# EAGLE schematic G_FY2015_Mez (EAGLE 6.5.0)

## Sheet 1 of 4: Raspberry Pi 2 and slow ADC/DAC
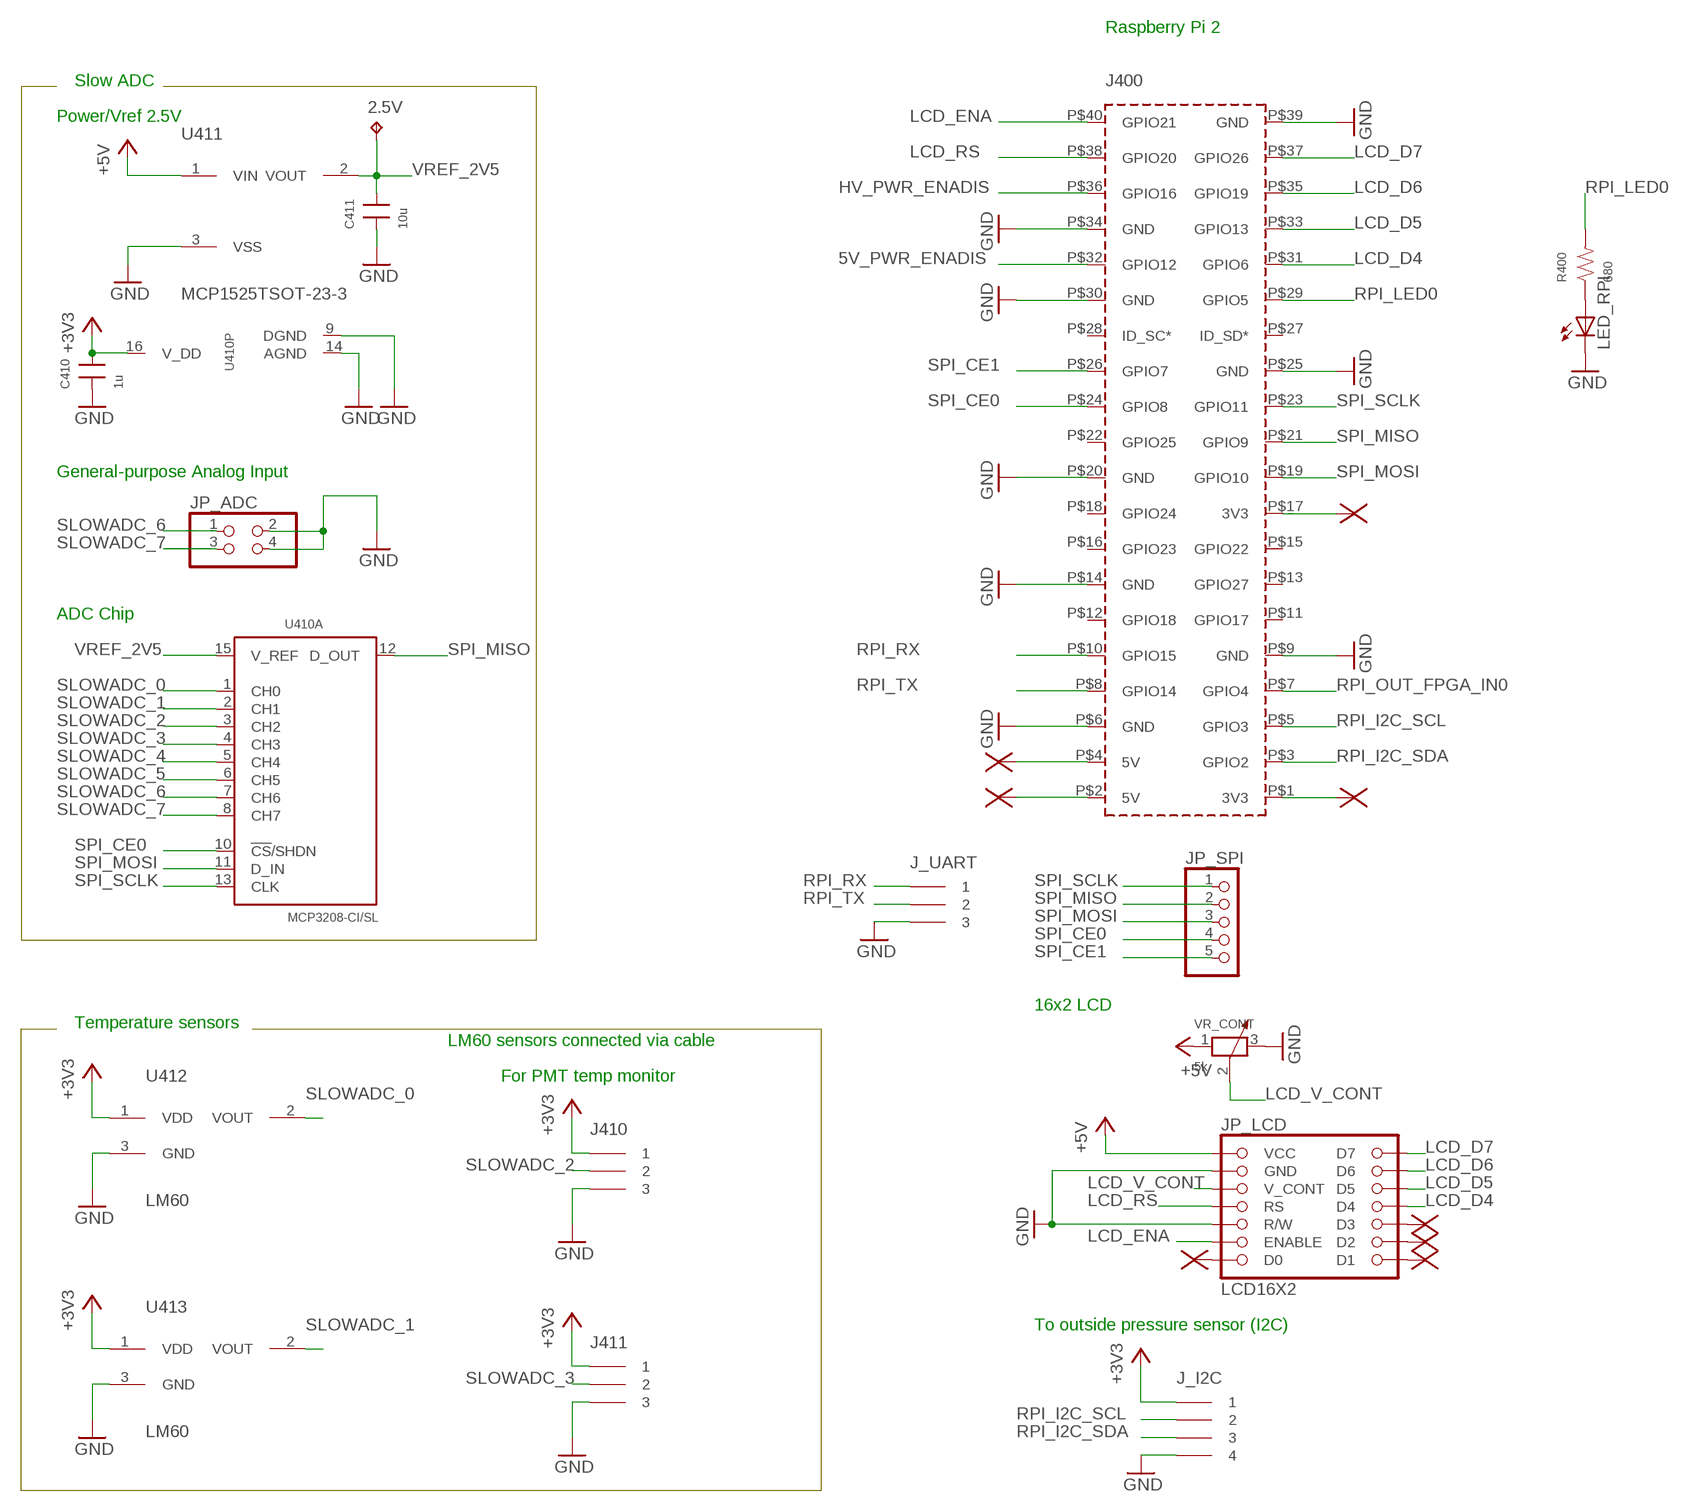
[diagram p0: schematic, sheet 1]

### Parts
2.5V  TPPAD1-13  [P1-13]
C410  1u  C226-3216  [3216]
C411  10u  C226-3216  [3216]
J400  RPI2_GPIO_HOLES  [RPI2_GPIO_HOLES]
J410  IL-3P-S3EN2  [IL-3P-S3EN2]
J411  IL-3P-S3EN2  [IL-3P-S3EN2]
J_I2C  IL-4P-S3EN2  [IL-4P-S3EN2]
J_UART  IL-3P-S3EN2  [IL-3P-S3EN2]
JP_ADC  PINHD-2X2  [2X02]
JP_LCD  LCD16X2  [LCD16X2]
JP_SPI  PINHD-1X5  [1X05]
LED_RPI  SML-311WTT86  LED_1608  [LED_1608]
R400  680  R2012  [2012]
U410  MCP3208-CI/SL  [SOIC-16(150MIL)(1.27MM)]
U411  MCP1525TSOT-23-3  [TSOT-23-3]
U412  LM60  [TO-92-R2.5C]
U413  LM60  [TO-92-R2.5C]
U$9  NC  (no package)
U$10  NC  (no package)
U$11  NC  (no package)
U$12  NC  (no package)
U$37  NC  (no package)
U$38  NC  (no package)
U$39  NC  (no package)
U$40  NC  (no package)
VR_CONT  5k  DIP-TRIMMER-10K-10%-1/2W(3P-9.7X5.0X9.80MM)  [ADJRP3-9.70XW5.0X9.80MM]

### Nets
5V_PWR_ENADIS: J400.P$32(GPIO12) ; also sheet 4
+3V3 [power]: C410.2 J410.P$1 J411.P$1 J_I2C.P$1 U410.16(P:V_DD) U412.1(VDD) U413.1(VDD) ; also sheet 2,4
+5V [power]: JP_LCD.1(VCC) U411.1(VIN) VR_CONT.1 ; also sheet 2,4
GND [power]: C410.1 C411.1 J400.P$6(GND) J400.P$9(GND) J400.P$14(GND) J400.P$20(GND) J400.P$25(GND) J400.P$30(GND) J400.P$34(GND) J400.P$39(GND) J410.P$3 J411.P$3 J_I2C.P$4 J_UART.P$3 JP_ADC.2 JP_ADC.4 JP_LCD.2(GND) JP_LCD.5(R/W) LED_RPI.P$2(C) U410.9(P:DGND) U410.14(P:AGND) U411.3(VSS) U412.3(GND) U413.3(GND) VR_CONT.3 ; also sheet 2,3,4
HV_PWR_ENADIS: J400.P$36(GPIO16) ; also sheet 3
LCD_D4: J400.P$31(GPIO6) JP_LCD.11(D4)
LCD_D5: J400.P$33(GPIO13) JP_LCD.12(D5)
LCD_D6: J400.P$35(GPIO19) JP_LCD.13(D6)
LCD_D7: J400.P$37(GPIO26) JP_LCD.14(D7)
LCD_ENA: J400.P$40(GPIO21) JP_LCD.6(ENABLE)
LCD_RS: J400.P$38(GPIO20) JP_LCD.4(RS)
LCD_V_CONT: JP_LCD.3(V_CONT) VR_CONT.2
N$51: J400.P$1(3V3) U$11.NC
N$52: J400.P$17(3V3) U$12.NC
N$56: J400.P$4(5V) U$9.NC
N$57: J400.P$2(5V) U$10.NC
N$69: LED_RPI.P$1(A) R400.1
N$94: JP_LCD.8(D1) U$37.NC
N$95: JP_LCD.9(D2) U$38.NC
N$96: JP_LCD.10(D3) U$39.NC
N$97: JP_LCD.7(D0) U$40.NC
RPI_I2C_SCL: J400.P$5(GPIO3) J_I2C.P$2
RPI_I2C_SDA: J400.P$3(GPIO2) J_I2C.P$3
RPI_LED0: J400.P$29(GPIO5) R400.2
RPI_OUT_FPGA_IN0: J400.P$7(GPIO4) ; also sheet 2
RPI_RX: J400.P$10(GPIO15) J_UART.P$1
RPI_TX: J400.P$8(GPIO14) J_UART.P$2
SLOWADC_0: U410.1(A:CH0) U412.2(VOUT)
SLOWADC_1: U410.2(A:CH1) U413.2(VOUT)
SLOWADC_2: J410.P$2 U410.3(A:CH2)
SLOWADC_3: J411.P$2 U410.4(A:CH3)
SLOWADC_4: U410.5(A:CH4) ; also sheet 4
SLOWADC_5: U410.6(A:CH5) ; also sheet 4
SLOWADC_6: JP_ADC.1 U410.7(A:CH6)
SLOWADC_7: JP_ADC.3 U410.8(A:CH7)
SPI_CE0: J400.P$24(GPIO8) JP_SPI.4 U410.10(A:!CS!/SHDN)
SPI_CE1: J400.P$26(GPIO7) JP_SPI.5
SPI_MISO: J400.P$21(GPIO9) JP_SPI.2 U410.12(A:D_OUT)
SPI_MOSI: J400.P$19(GPIO10) JP_SPI.3 U410.11(A:D_IN)
SPI_SCLK: J400.P$23(GPIO11) JP_SPI.1 U410.13(A:CLK)
VREF_2V5: 2.5V.TP C411.2 U410.15(A:V_REF) U411.2(VOUT)
Unconnected: J400.P$11(GPIO17) J400.P$12(GPIO18) J400.P$13(GPIO27) J400.P$15(GPIO22) J400.P$16(GPIO23) J400.P$18(GPIO24) J400.P$22(GPIO25) J400.P$27(ID_SD*) J400.P$28(ID_SC*)

### Notes on the sheet
- Raspberry Pi 2
- Slow ADC
- Power/Vref 2.5V
- General-purpose Analog Input
- ADC Chip
- 16x2 LCD
- Temperature sensors
- LM60 sensors connected via cable
- For PMT temp monitor
- To outside pressure sensor (I2C)

## Sheet 2 of 4: Amp/ADC/FPGA
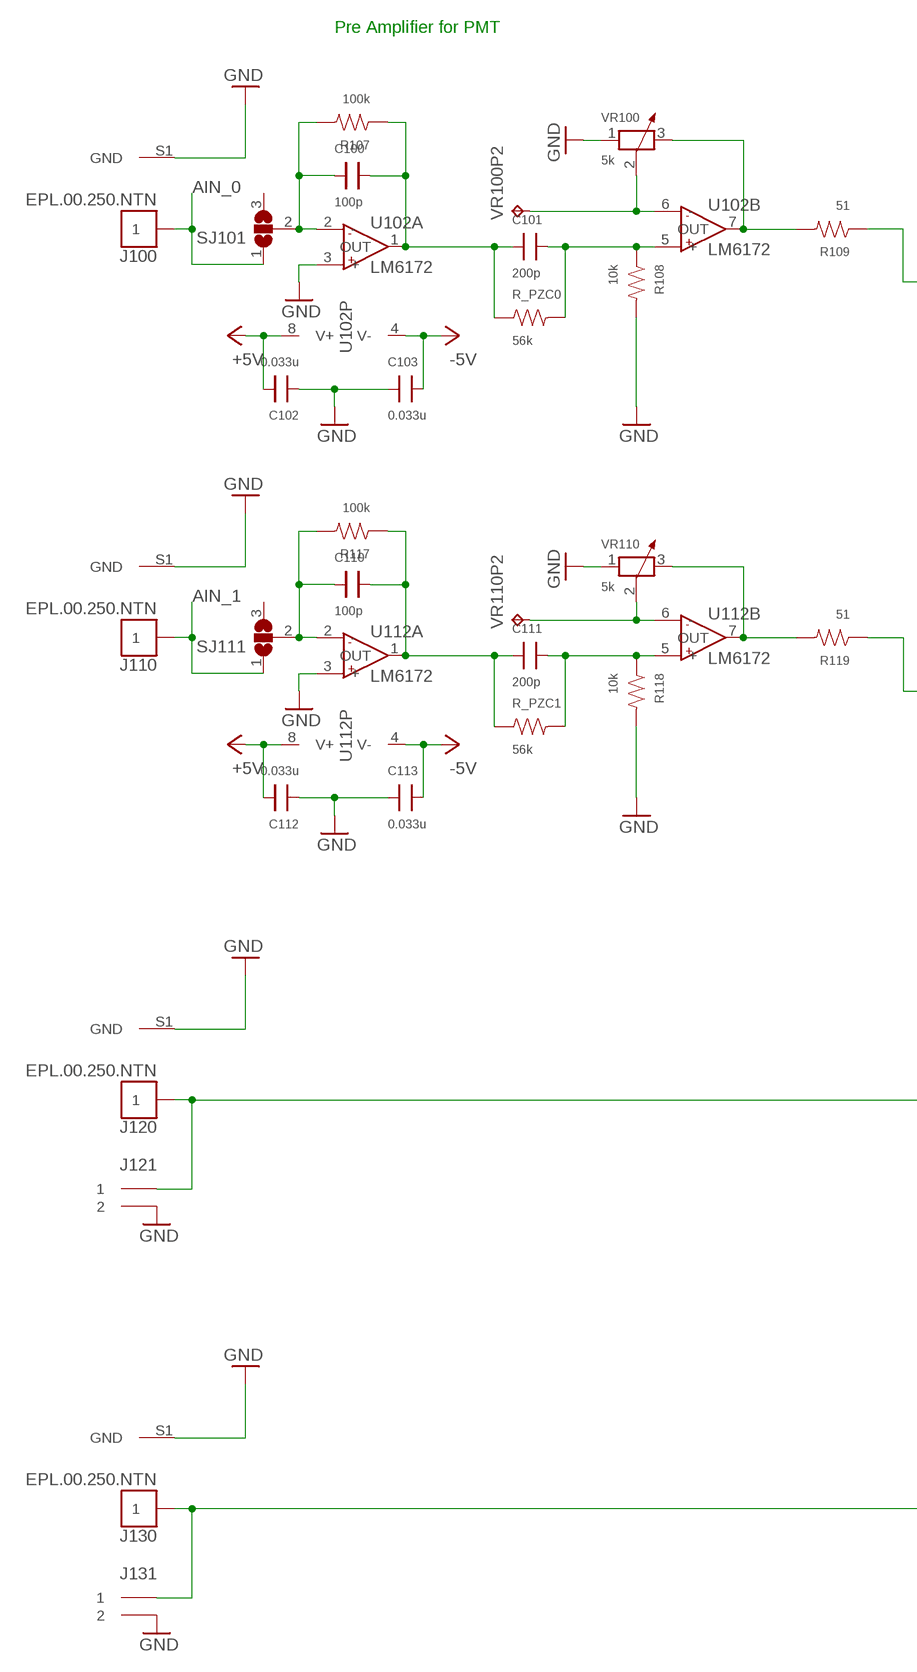
[diagram p1: schematic, sheet 2, part 1 of 2]
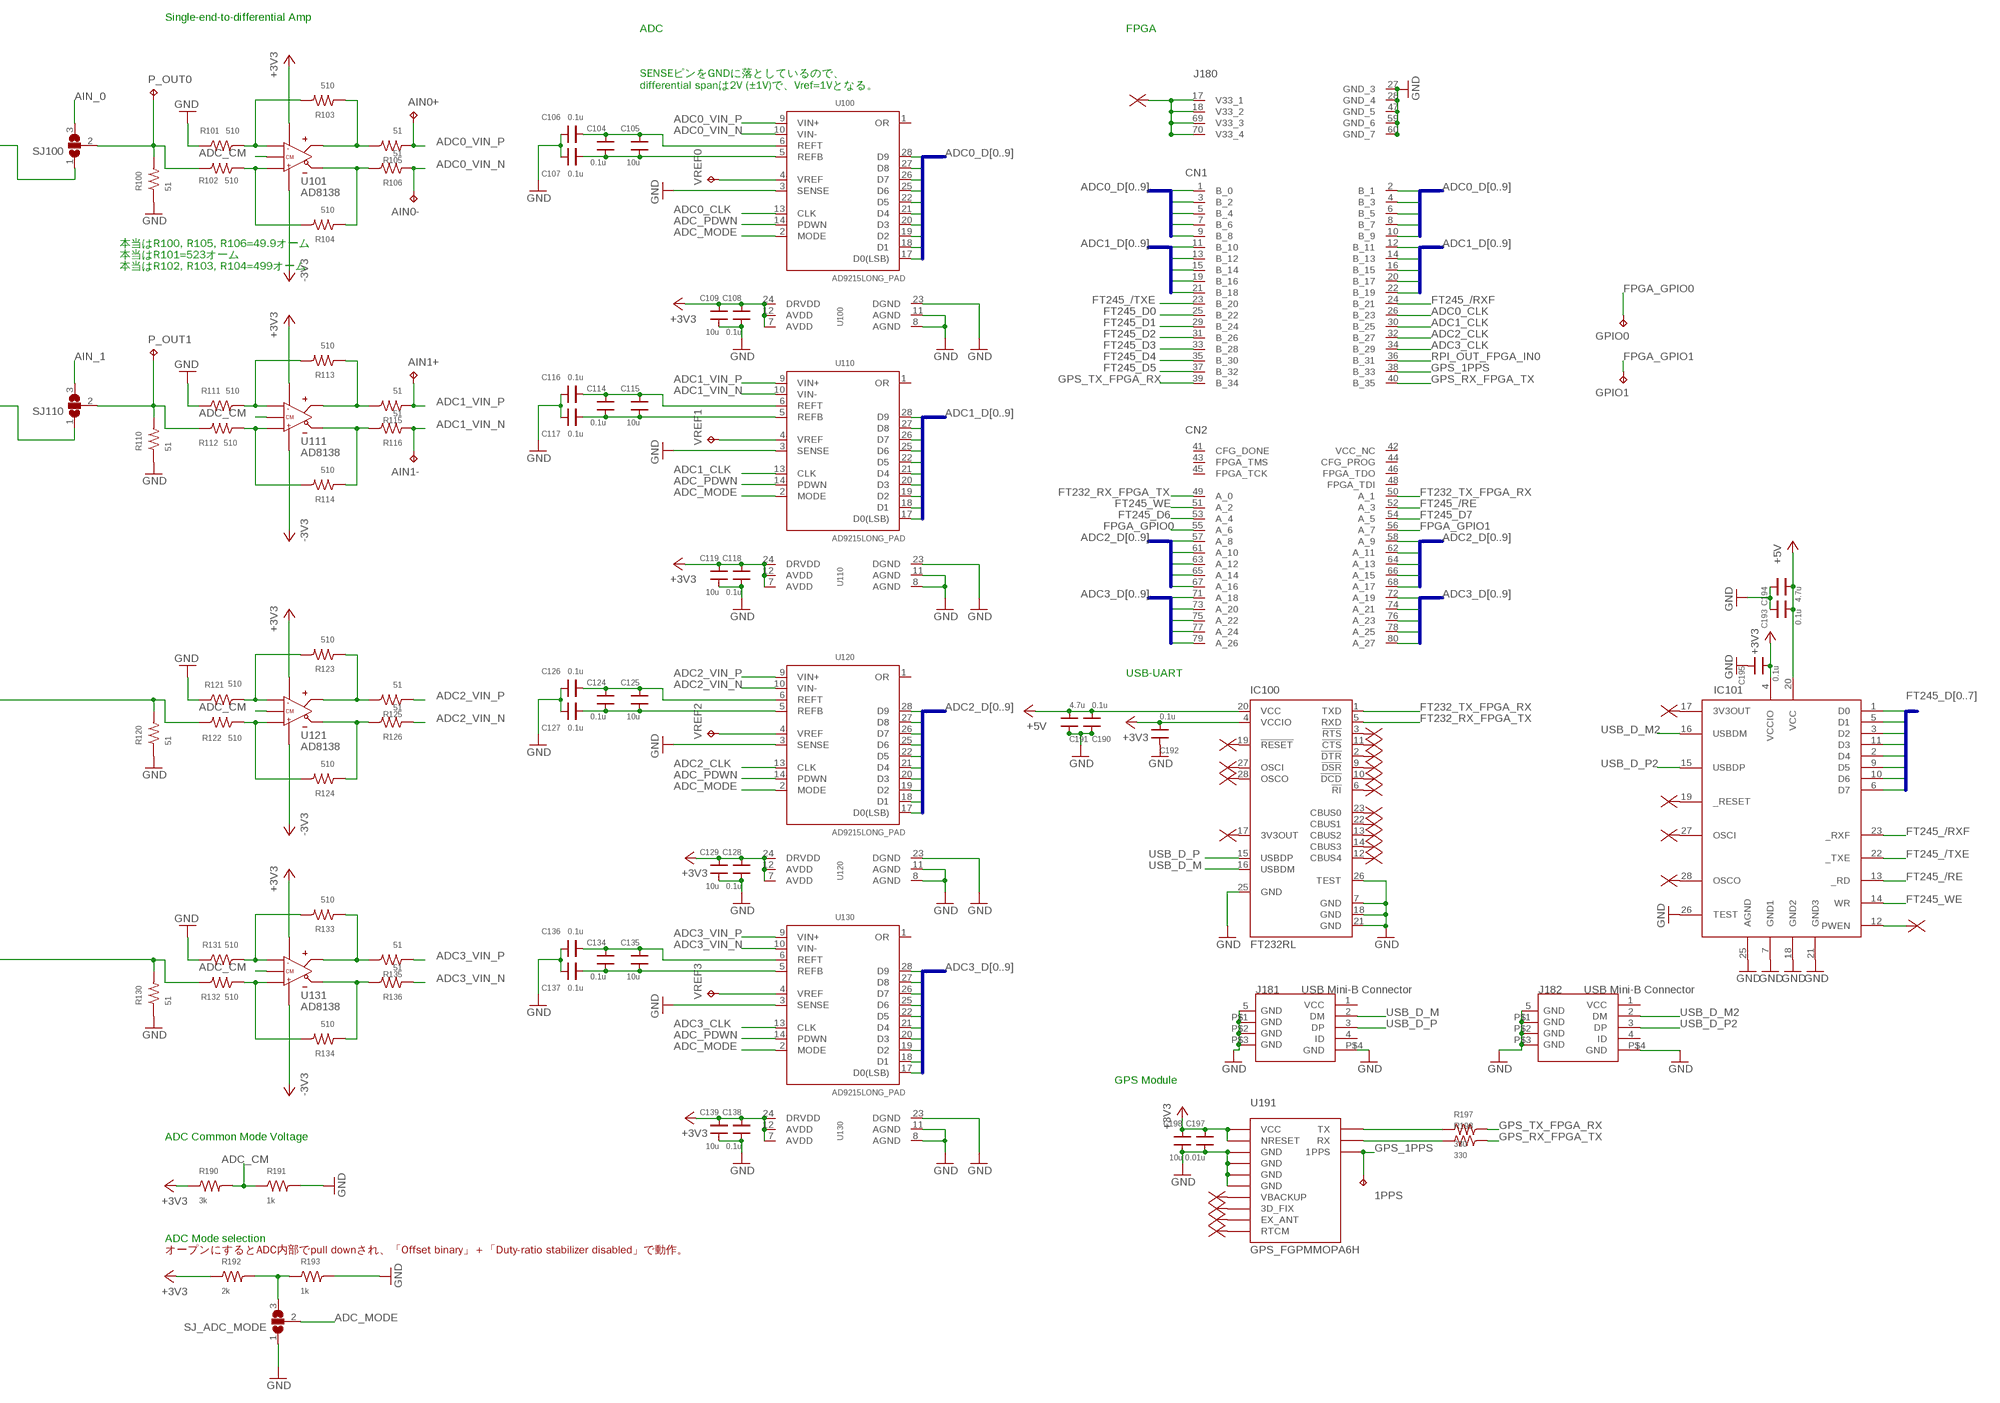
[diagram p2: schematic, sheet 2, part 2 of 2]

### Parts
1PPS  TPPAD1-13  [P1-13]
AIN0+  TPPAD1-13  [P1-13]
AIN0-  TPPAD1-13  [P1-13]
AIN1+  TPPAD1-13  [P1-13]
AIN1-  TPPAD1-13  [P1-13]
C100  100p  C2012  [C0805]
C101  200p  C2012  [C0805]
C102  0.033u  C2012  [C0805]
C103  0.033u  C2012  [C0805]
C104  0.1u  C2012  [C0805]
C105  10u  C2012  [C0805]
C106  0.1u  C2012  [C0805]
C107  0.1u  C2012  [C0805]
C108  0.1u  C2012  [C0805]
C109  10u  C2012  [C0805]
C110  100p  C2012  [C0805]
C111  200p  C2012  [C0805]
C112  0.033u  C2012  [C0805]
C113  0.033u  C2012  [C0805]
C114  0.1u  C2012  [C0805]
C115  10u  C2012  [C0805]
C116  0.1u  C2012  [C0805]
C117  0.1u  C2012  [C0805]
C118  0.1u  C2012  [C0805]
C119  10u  C2012  [C0805]
C124  0.1u  C2012  [C0805]
C125  10u  C2012  [C0805]
C126  0.1u  C2012  [C0805]
C127  0.1u  C2012  [C0805]
C128  0.1u  C2012  [C0805]
C129  10u  C2012  [C0805]
C134  0.1u  C2012  [C0805]
C135  10u  C2012  [C0805]
C136  0.1u  C2012  [C0805]
C137  0.1u  C2012  [C0805]
C138  0.1u  C2012  [C0805]
C139  10u  C2012  [C0805]
C190  0.1u  C2012  [C0805]
C191  4.7u  C2012  [C0805]
C192  0.1u  C2012  [C0805]
C193  0.1u  C2012  [C0805]
C194  4.7u  C2012  [C0805]
C195  0.1u  C2012  [C0805]
C197  0.01u  C1608  [C0603]
C198  10u  C226-3216  [3216]
GPIO0  TPPAD1-13  [P1-13]
GPIO1  TPPAD1-13  [P1-13]
IC100  FT232RL  [SSOP28]
IC101  FT245RL  [SSOP28DB]
J100  EPL.00.250.NTN  [EPL.00.250.NTN]
J110  EPL.00.250.NTN  [EPL.00.250.NTN]
J120  EPL.00.250.NTN  [EPL.00.250.NTN]
J121  IL-2P-S3EN2  [IL-2P-S3EN2]
J130  EPL.00.250.NTN  [EPL.00.250.NTN]
J131  IL-2P-S3EN2  [IL-2P-S3EN2]
J180  TOKUDEN_SP6  [TOKUDEN_SP6]
J181  USB Mini-B Connector  MINI-USB-RCPT-B-5PS-R/A-SMD(ST-USB-002A)  [MINIUSB5+4P-SMD-0.8-90D]
J182  USB Mini-B Connector  MINI-USB-RCPT-B-5PS-R/A-SMD(ST-USB-002A)  [MINIUSB5+4P-SMD-0.8-90D]
P_OUT0  TPPAD1-13  [P1-13]
P_OUT1  TPPAD1-13  [P1-13]
R100  51  R2012  [2012]
R101  510  R2012  [2012]
R102  510  R2012  [2012]
R103  510  R2012  [2012]
R104  510  R2012  [2012]
R105  51  R2012  [2012]
R106  51  R2012  [2012]
R107  100k  R2012  [2012]
R108  10k  R2012  [2012]
R109  51  R2012  [2012]
R110  51  R2012  [2012]
R111  510  R2012  [2012]
R112  510  R2012  [2012]
R113  510  R2012  [2012]
R114  510  R2012  [2012]
R115  51  R2012  [2012]
R116  51  R2012  [2012]
R117  100k  R2012  [2012]
R118  10k  R2012  [2012]
R119  51  R2012  [2012]
R120  51  R2012  [2012]
R121  510  R2012  [2012]
R122  510  R2012  [2012]
R123  510  R2012  [2012]
R124  510  R2012  [2012]
R125  51  R2012  [2012]
R126  51  R2012  [2012]
R130  51  R2012  [2012]
R131  510  R2012  [2012]
R132  510  R2012  [2012]
R133  510  R2012  [2012]
R134  510  R2012  [2012]
R135  51  R2012  [2012]
R136  51  R2012  [2012]
R190  3k  R2012  [2012]
R191  1k  R2012  [2012]
R192  2k  R2012  [2012]
R193  1k  R2012  [2012]
R197  330  R2012  [2012]
R198  330  R2012  [2012]
R_PZC0  56k  R2012  [2012]
R_PZC1  56k  R2012  [2012]
SJ100  SJ2WW  [SJ_2W]
SJ101  SJ2WW  [SJ_2W]
SJ110  SJ2WW  [SJ_2W]
SJ111  SJ2WW  [SJ_2W]
SJ_ADC_MODE  SJ2WW  [SJ_2W]
U100  AD9215LONG_PAD  [TSSOP-28(4.4MM)(0.65MM)_LONGPAD]
U101  AD8138  [SOIC-8(150MIL)(1.27MM)]
U102  LM6172  LM6172SOIC(D)8  [SOP8]
U110  AD9215LONG_PAD  [TSSOP-28(4.4MM)(0.65MM)_LONGPAD]
U111  AD8138  [SOIC-8(150MIL)(1.27MM)]
U112  LM6172  LM6172SOIC(D)8  [SOP8]
U120  AD9215LONG_PAD  [TSSOP-28(4.4MM)(0.65MM)_LONGPAD]
U121  AD8138  [SOIC-8(150MIL)(1.27MM)]
U130  AD9215LONG_PAD  [TSSOP-28(4.4MM)(0.65MM)_LONGPAD]
U131  AD8138  [SOIC-8(150MIL)(1.27MM)]
U191  GPS_FGPMMOPA6H  [GPS_FGPMMOPA6H]
U$1  NC  (no package)
U$2  NC  (no package)
U$3  NC  (no package)
U$8  NC  (no package)
U$13  NC  (no package)
U$14  NC  (no package)
U$15  NC  (no package)
U$16  NC  (no package)
U$18  NC  (no package)
U$20  NC  (no package)
U$21  NC  (no package)
U$23  NC  (no package)
U$24  NC  (no package)
U$25  NC  (no package)
U$26  NC  (no package)
U$29  NC  (no package)
U$32  NC  (no package)
U$33  NC  (no package)
U$34  NC  (no package)
U$35  NC  (no package)
U$36  NC  (no package)
U$41  NC  (no package)
U$42  NC  (no package)
U$43  NC  (no package)
U$44  NC  (no package)
VR100  5k  DIP-TRIMMER-10K-10%-1/2W(3P-9.7X5.0X9.80MM)  [ADJRP3-9.70XW5.0X9.80MM]
VR100P2  TPPAD1-13  [P1-13]
VR110  5k  DIP-TRIMMER-10K-10%-1/2W(3P-9.7X5.0X9.80MM)  [ADJRP3-9.70XW5.0X9.80MM]
VR110P2  TPPAD1-13  [P1-13]
VREF0  TPPAD1-13  [P1-13]
VREF1  TPPAD1-13  [P1-13]
VREF2  TPPAD1-13  [P1-13]
VREF3  TPPAD1-13  [P1-13]

### Nets
+3V3 [power]: C108.2 C109.2 C118.2 C119.2 C128.2 C129.2 C138.2 C139.2 C192.1 C195.1 C197.2 C198.2 IC100.4(VCCIO) IC101.4(VCCIO) R190.1 R192.1 U100.7(AVDD) U100.12(AVDD) U100.24(DRVDD) U101.3(V+) U110.7(AVDD) U110.12(AVDD) U110.24(DRVDD) U111.3(V+) U120.7(AVDD) U120.12(AVDD) U120.24(DRVDD) U121.3(V+) U130.7(AVDD) U130.12(AVDD) U130.24(DRVDD) U131.3(V+) U191.P$1(VCC) U191.P$2(NRESET) ; also sheet 1,4
+5V [power]: C102.2 C112.2 C190.1 C191.1 C193.1 C194.1 IC100.20(VCC) IC101.20(VCC) U102.8(P:V+) U112.8(P:V+) ; also sheet 1,4
-3V3: U101.6(V-) U111.6(V-) U121.6(V-) U131.6(V-) ; also sheet 4
-5V: C103.2 C113.2 U102.4(P:V-) U112.4(P:V-) ; also sheet 4
ADC0_CLK: J180.26(B_23) U100.13(CLK)
ADC0_D0: J180.1(B_0) U100.17(D0(LSB))
ADC0_D1: J180.2(B_1) U100.18(D1)
ADC0_D2: J180.3(B_2) U100.19(D2)
ADC0_D3: J180.4(B_3) U100.20(D3)
ADC0_D4: J180.5(B_4) U100.21(D4)
ADC0_D5: J180.6(B_5) U100.22(D5)
ADC0_D6: J180.7(B_6) U100.25(D6)
ADC0_D7: J180.8(B_7) U100.26(D7)
ADC0_D8: J180.9(B_8) U100.27(D8)
ADC0_D9: J180.10(B_9) U100.28(D9)
ADC0_VIN_N: AIN0-.TP R106.1 U100.10(VIN-)
ADC0_VIN_P: AIN0+.TP R105.1 U100.9(VIN+)
ADC1_CLK: J180.30(B_25) U110.13(CLK)
ADC1_D0: J180.11(B_10) U110.17(D0(LSB))
ADC1_D1: J180.12(B_11) U110.18(D1)
ADC1_D2: J180.13(B_12) U110.19(D2)
ADC1_D3: J180.14(B_13) U110.20(D3)
ADC1_D4: J180.15(B_14) U110.21(D4)
ADC1_D5: J180.16(B_15) U110.22(D5)
ADC1_D6: J180.19(B_16) U110.25(D6)
ADC1_D7: J180.20(B_17) U110.26(D7)
ADC1_D8: J180.21(B_18) U110.27(D8)
ADC1_D9: J180.22(B_19) U110.28(D9)
ADC1_VIN_N: AIN1-.TP R116.1 U110.10(VIN-)
ADC1_VIN_P: AIN1+.TP R115.1 U110.9(VIN+)
ADC2_CLK: J180.32(B_27) U120.13(CLK)
ADC2_D0: J180.57(A_8) U120.17(D0(LSB))
ADC2_D1: J180.58(A_9) U120.18(D1)
ADC2_D2: J180.61(A_10) U120.19(D2)
ADC2_D3: J180.62(A_11) U120.20(D3)
ADC2_D4: J180.63(A_12) U120.21(D4)
ADC2_D5: J180.64(A_13) U120.22(D5)
ADC2_D6: J180.65(A_14) U120.25(D6)
ADC2_D7: J180.66(A_15) U120.26(D7)
ADC2_D8: J180.67(A_16) U120.27(D8)
ADC2_D9: J180.68(A_17) U120.28(D9)
ADC2_VIN_N: R126.1 U120.10(VIN-)
ADC2_VIN_P: R125.1 U120.9(VIN+)
ADC3_CLK: J180.34(B_29) U130.13(CLK)
ADC3_D0: J180.71(A_18) U130.17(D0(LSB))
ADC3_D1: J180.72(A_19) U130.18(D1)
ADC3_D2: J180.73(A_20) U130.19(D2)
ADC3_D3: J180.74(A_21) U130.20(D3)
ADC3_D4: J180.75(A_22) U130.21(D4)
ADC3_D5: J180.76(A_23) U130.22(D5)
ADC3_D6: J180.77(A_24) U130.25(D6)
ADC3_D7: J180.78(A_25) U130.26(D7)
ADC3_D8: J180.79(A_26) U130.27(D8)
ADC3_D9: J180.80(A_27) U130.28(D9)
ADC3_VIN_N: R136.1 U130.10(VIN-)
ADC3_VIN_P: R135.1 U130.9(VIN+)
ADC_CM: R190.2 R191.1 U101.2(CM) U111.2(CM) U121.2(CM) U131.2(CM)
ADC_MODE: SJ_ADC_MODE.2 U100.2(MODE) U110.2(MODE) U120.2(MODE) U130.2(MODE)
ADC_PDWN: U100.14(PDWN) U110.14(PDWN) U120.14(PDWN) U130.14(PDWN)
AIN_0: J100.1 SJ100.3 SJ101.1
AIN_1: J110.1 SJ110.3 SJ111.1
AIN_2: J120.1 J121.P$1 R120.2 R122.2
AIN_3: J130.1 J131.P$1 R130.2 R132.2
FPGA_GPIO0: GPIO0.TP J180.55(A_6)
FPGA_GPIO1: GPIO1.TP J180.56(A_7)
FT232_RX_FPGA_TX: IC100.5(RXD) J180.49(A_0)
FT232_TX_FPGA_RX: IC100.1(TXD) J180.50(A_1)
FT245_/RE: IC101.13(_RD) J180.52(A_3)
FT245_/RXF: IC101.23(_RXF) J180.24(B_21)
FT245_/TXE: IC101.22(_TXE) J180.23(B_20)
FT245_D0: IC101.1(D0) J180.25(B_22)
FT245_D1: IC101.5(D1) J180.29(B_24)
FT245_D2: IC101.3(D2) J180.31(B_26)
FT245_D3: IC101.11(D3) J180.33(B_28)
FT245_D4: IC101.2(D4) J180.35(B_30)
FT245_D5: IC101.9(D5) J180.37(B_32)
FT245_D6: IC101.10(D6) J180.53(A_4)
FT245_D7: IC101.6(D7) J180.54(A_5)
FT245_WE: IC101.14(WR) J180.51(A_2)
GND [power]: C102.1 C103.1 C106.2 C107.2 C108.1 C109.1 C112.1 C113.1 C116.2 C117.2 C118.1 C119.1 C126.2 C127.2 C128.1 C129.1 C136.2 C137.2 C138.1 C139.1 C190.2 C191.2 C192.2 C193.2 C194.2 C195.2 C197.1 C198.1 IC100.7(GND) IC100.18(GND) IC100.21(GND) IC100.25(GND) IC100.26(TEST) IC101.7(GND1) IC101.18(GND2) IC101.21(GND3) IC101.25(AGND) IC101.26(TEST) J100.S1(GND) J110.S1(GND) J120.S1(GND) J121.P$2 J130.S1(GND) J131.P$2 J180.27(GND_3) J180.28(GND_4) J180.47(GND_5) J180.59(GND_6) J180.60(GND_7) J181.5(GND) J181.P$1(GND) J181.P$2(GND) J181.P$3(GND) J181.P$4(GND) J182.5(GND) J182.P$1(GND) J182.P$2(GND) J182.P$3(GND) J182.P$4(GND) R100.1 R101.1 R108.2 R110.1 R111.1 R118.2 R120.1 R121.1 R130.1 R131.1 R191.2 R193.2 SJ_ADC_MODE.1 U100.3(SENSE) U100.8(AGND) U100.11(AGND) U100.23(DGND) U102.3(A:+) U110.3(SENSE) U110.8(AGND) U110.11(AGND) U110.23(DGND) U112.3(A:+) U120.3(SENSE) U120.8(AGND) U120.11(AGND) U120.23(DGND) U130.3(SENSE) U130.8(AGND) U130.11(AGND) U130.23(DGND) U191.P$3(GND) U191.P$8(GND) U191.P$12(GND) U191.P$19(GND) VR100.1 VR110.1 ; also sheet 1,3,4
GPS_1PPS: 1PPS.TP J180.38(B_33) U191.P$13(1PPS)
GPS_RX_FPGA_TX: J180.40(B_35) R198.2
GPS_TX_FPGA_RX: J180.39(B_34) R197.2
N$2: R101.2 R103.2 U101.1(-)
N$10: U100.4(VREF) VREF0.TP
N$11: C104.2 C105.2 C106.1 U100.6(REFT)
N$12: U110.4(VREF) VREF1.TP
N$13: C114.2 C115.2 C116.1 U110.6(REFT)
N$14: C104.1 C105.1 C107.1 U100.5(REFB)
N$15: C114.1 C115.1 C117.1 U110.5(REFB)
N$16: U120.4(VREF) VREF2.TP
N$17: C124.2 C125.2 C126.1 U120.6(REFT)
N$18: C124.1 C125.1 C127.1 U120.5(REFB)
N$19: U130.4(VREF) VREF3.TP
N$20: C134.2 C135.2 C136.1 U130.6(REFT)
N$21: IC100.23(CBUS0) U$32.NC
N$22: IC100.22(CBUS1) U$33.NC
N$23: C134.1 C135.1 C137.1 U130.5(REFB)
N$24: IC100.10(!DCD) U$23.NC
N$25: IC100.19(!RESET) U$1.NC
N$26: IC100.9(!DSR) U$24.NC
N$27: IC100.2(!DTR) U$25.NC
N$28: IC100.6(!RI) U$26.NC
N$29: IC100.13(CBUS2) U$34.NC
N$30: IC100.14(CBUS3) U$35.NC
N$31: IC100.12(CBUS4) U$36.NC
N$32: IC100.27(OSCI) U$2.NC
N$33: IC100.28(OSCO) U$3.NC
N$35: IC100.17(3V3OUT) U$29.NC
N$36: R102.1 R104.2 U101.8(+)
N$37: R111.2 R113.2 U111.1(-)
N$38: R104.1 R106.2 U101.5(O-)
N$39: R103.1 R105.2 U101.4(O+)
N$40: R112.1 R114.2 U111.8(+)
N$41: R114.1 R116.2 U111.5(O-)
N$42: R113.1 R115.2 U111.4(O+)
N$43: R121.2 R123.2 U121.1(-)
N$44: R122.1 R124.2 U121.8(+)
N$45: R124.1 R126.2 U121.5(O-)
N$46: R123.1 R125.2 U121.4(O+)
N$47: R131.2 R133.2 U131.1(-)
N$48: R132.1 R134.2 U131.8(+)
N$49: R134.1 R136.2 U131.5(O-)
N$50: R133.1 R135.2 U131.4(O+)
N$53: J180.17(V33_1) J180.18(V33_2) J180.69(V33_3) J180.70(V33_4) U$8.NC
N$54: C100.2 C101.1 R107.1 R_PZC0.1 U102.1(A:OUT)
N$55: C101.2 R108.1 R_PZC0.2 U102.5(B:+)
N$60: R197.1 U191.P$9(TX)
N$61: C110.2 C111.1 R117.1 R_PZC1.1 U112.1(A:OUT)
N$62: U112.6(B:-) VR110.2 VR110P2.TP
N$63: C111.2 R118.1 R_PZC1.2 U112.5(B:+)
N$64: U191.P$4(VBACKUP) U$18.NC
N$65: U191.P$5(3D_FIX) U$42.NC
N$66: U191.P$11(EX_ANT) U$20.NC
N$67: U191.P$14(RTCM) U$21.NC
N$68: R198.1 U191.P$10(RX)
N$73: U102.6(B:-) VR100.2 VR100P2.TP
N$92: R119.2 U112.7(B:OUT) VR110.3
N$99: R192.2 R193.1 SJ_ADC_MODE.3
N$100: R109.2 U102.7(B:OUT) VR100.3
N$101: R109.1 SJ100.1
N$102: R119.1 SJ110.1
N$105: C110.1 R117.2 SJ111.2 U112.2(A:-)
N$106: C100.1 R107.2 SJ101.2 U102.2(A:-)
N$107: IC101.19(_RESET) U$13.NC
N$109: IC101.27(OSCI) U$14.NC
N$110: IC101.28(OSCO) U$15.NC
N$111: IC101.17(3V3OUT) U$16.NC
N$112: IC100.3(!RTS) U$43.NC
N$113: IC100.11(!CTS) U$44.NC
N$116: IC101.12(PWEN) U$41.NC
PREAMP0_OUT: P_OUT0.TP R100.2 R102.2 SJ100.2
PREAMP1_OUT: P_OUT1.TP R110.2 R112.2 SJ110.2
RPI_OUT_FPGA_IN0: J180.36(B_31) ; also sheet 1
USB_D_M: IC100.16(USBDM) J181.2(DM)
USB_D_M2: IC101.16(USBDM) J182.2(DM)
USB_D_P: IC100.15(USBDP) J181.3(DP)
USB_D_P2: IC101.15(USBDP) J182.3(DP)
Unconnected: J180.41(CFG_DONE) J180.42(VCC_NC) J180.43(FPGA_TMS) J180.44(CFG_PROG) J180.45(FPGA_TCK) J180.46(FPGA_TDO) J180.48(FPGA_TDI) J181.1(VCC) J181.4(ID) J182.1(VCC) J182.4(ID) SJ101.3 SJ111.3 U100.1(OR) U110.1(OR) U120.1(OR) U130.1(OR)

### Buses
ADC0_D[0..9]
ADC1_D[0..9]
ADC2_D[0..9]
ADC3_D[0..9]
FT245_D[0..7]

### Notes on the sheet
- Pre Amplifier for PMT | Single-end-to-differential Amp
- ADC | FPGA
- SENSEピンをGNDに落としているので、
  differential spanは2V (±1V)で、Vref=1Vとなる。
- 本当はR100, R105, R106=49.9オーム
- 本当はR101=523オーム
- 本当はR102, R103, R104=499オーム
- USB-UART
- GPS Module
- ADC Common Mode Voltage
- ADC Mode selection
- オープンにするとADC内部でpull downされ、「Offset binary」＋「Duty-ratio stabilizer disabled」で動作。

## Sheet 3 of 4: HVPS
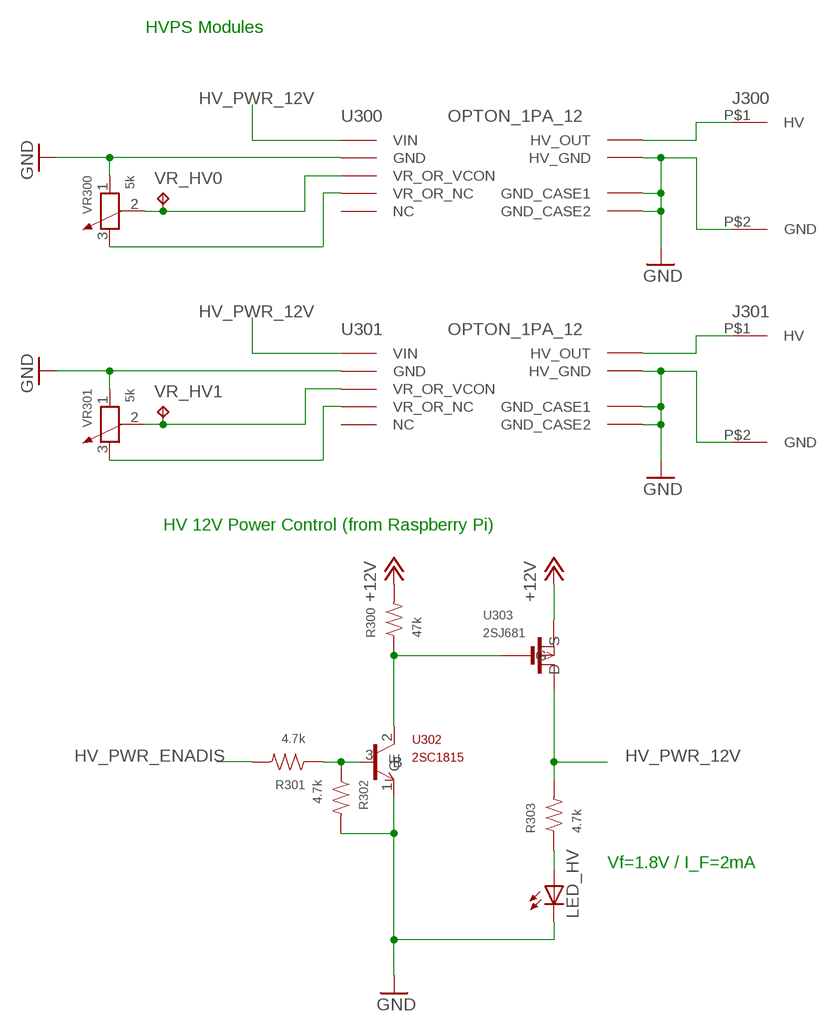
[diagram p3: schematic, sheet 3]

### Parts
J300  SHV_PIGTAIL_LAND  [SHV_PIGTAIL_LAND]
J301  SHV_PIGTAIL_LAND  [SHV_PIGTAIL_LAND]
LED_HV  SML-311WTT86  LED_1608  [LED_1608]
R300  47k  R2012  [2012]
R301  4.7k  R2012  [2012]
R302  4.7k  R2012  [2012]
R303  4.7k  R2012  [2012]
U300  OPTON_1PA_12  [OPTON_PA]
U301  OPTON_1PA_12  [OPTON_PA]
U302  2SC1815  [TO-92-R2.5C]
U303  2SJ681  [2-7J2B]
VR300  5k  DIP-TRIMMER-10K-10%-1/2W(3P-9.7X5.0X9.80MM)  [ADJRP3-9.70XW5.0X9.80MM]
VR301  5k  DIP-TRIMMER-10K-10%-1/2W(3P-9.7X5.0X9.80MM)  [ADJRP3-9.70XW5.0X9.80MM]
VR_HV0  TPPAD1-13  [P1-13]
VR_HV1  TPPAD1-13  [P1-13]

### Nets
+12V [power]: R300.2 U303.P$3(S) ; also sheet 4
GND [power]: J300.P$2(GND) J301.P$2(GND) LED_HV.P$2(C) R302.2 U300.P$2(GND) U300.P$6(HV_GND) U300.P$8(GND_CASE1) U300.P$9(GND_CASE2) U301.P$2(GND) U301.P$6(HV_GND) U301.P$8(GND_CASE1) U301.P$9(GND_CASE2) U302.1(E) VR300.1 VR301.1 ; also sheet 1,2,4
HV_PWR_12V [power]: R303.2 U300.P$1(VIN) U301.P$1(VIN) U303.P$2(D)
HV_PWR_ENADIS: R301.2 ; also sheet 1
N$1 [power]: J300.P$1(HV) U300.P$7(HV_OUT)
N$3: U300.P$3(VR_OR_VCON) VR300.2 VR_HV0.TP
N$4 [power]: J301.P$1(HV) U301.P$7(HV_OUT)
N$5: U300.P$4(VR_OR_NC) VR300.3
N$6: U301.P$3(VR_OR_VCON) VR301.2 VR_HV1.TP
N$7: U301.P$4(VR_OR_NC) VR301.3
N$58: LED_HV.P$1(A) R303.1
N$85: R300.1 U302.2(C) U303.P$1(G)
N$87: R301.1 R302.1 U302.3(B)
Unconnected: U300.P$5(NC) U301.P$5(NC)

### Notes on the sheet
- HVPS Modules
- HV 12V Power Control (from Raspberry Pi)
- Vf=1.8V / I_F=2mA

## Sheet 4 of 4: Power
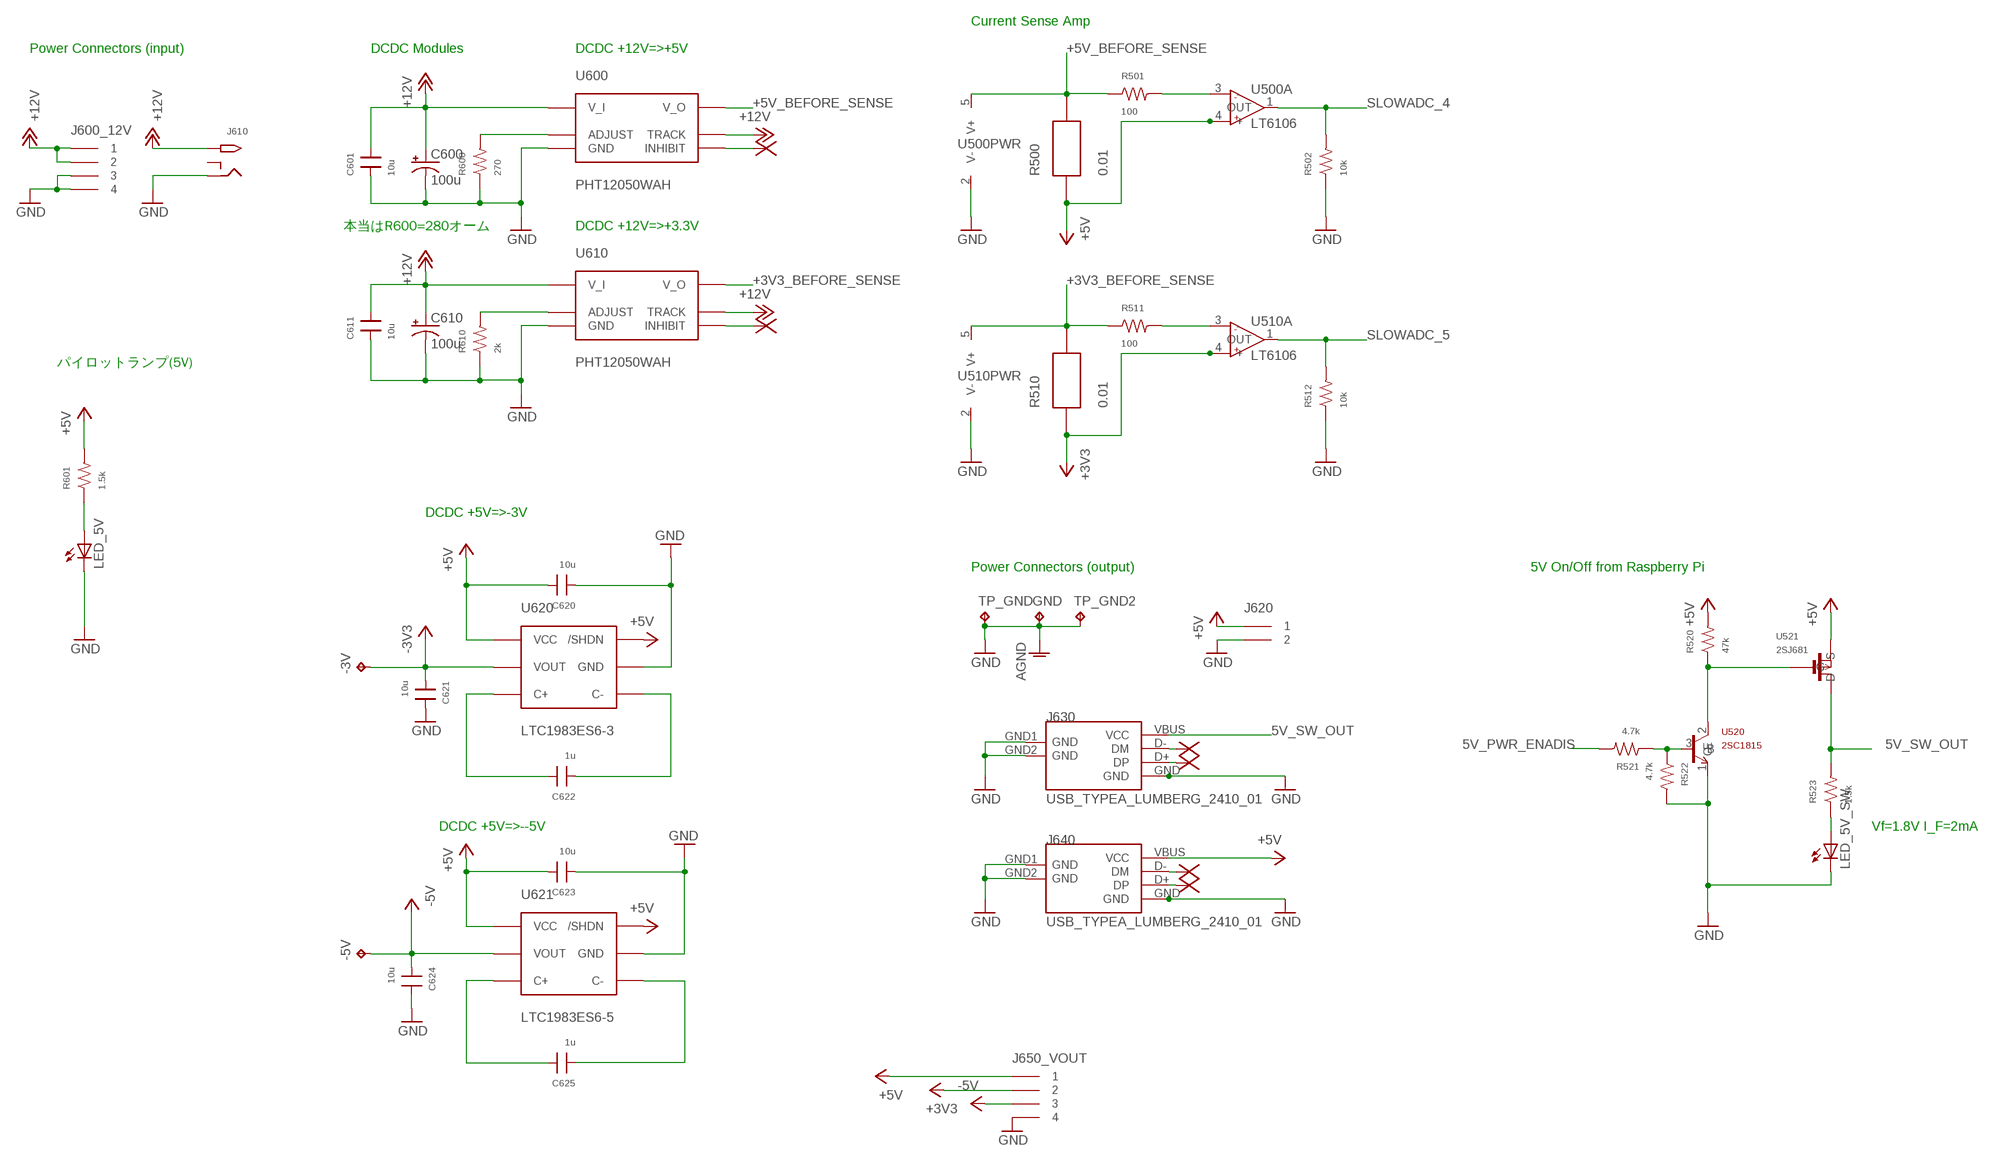
[diagram p4: schematic, sheet 4]

### Parts
-3V  TPPAD1-13  [P1-13]
-5V  TPPAD1-13  [P1-13]
C600  100u  CPOL-USE2.5-5  [E2,5-5]
C601  10u  C226-3216  [3216]
C610  100u  CPOL-USE2.5-5  [E2,5-5]
C611  10u  C226-3216  [3216]
C620  10u  C226-3216  [3216]
C621  10u  C226-3216  [3216]
C622  1u  C226-3216  [3216]
C623  10u  C226-3216  [3216]
C624  10u  C226-3216  [3216]
C625  1u  C226-3216  [3216]
GND  TPPAD1-13  [P1-13]
J600_12V  IL-4P-S3EN2  [IL-4P-S3EN2]
J610  2.1MMJACKTHM  [PJ-102A]
J620  IL-2P-S3EN2  [IL-2P-S3EN2]
J630  USB_TYPEA_LUMBERG_2410_01  [LUMBERG_2410-01]
J640  USB_TYPEA_LUMBERG_2410_01  [LUMBERG_2410-01]
J650_VOUT  IL-4P-S3EN2  [IL-4P-S3EN2]
LED_5V  SML-311WTT86  LED_1608  [LED_1608]
LED_5V_SW  SML-311WTT86  LED_1608  [LED_1608]
R500  0.01  R_LVR03  [R_LVR03]
R501  100  R2012  [2012]
R502  10k  R2012  [2012]
R510  0.01  R_LVR03  [R_LVR03]
R511  100  R2012  [2012]
R512  10k  R2012  [2012]
R520  47k  R2012  [2012]
R521  4.7k  R2012  [2012]
R522  4.7k  R2012  [2012]
R523  1.5k  R2012  [2012]
R600  270  R2012  [2012]
R601  1.5k  R2012  [2012]
R610  2k  R2012  [2012]
TP_GND  TPPAD1-13  [P1-13]
TP_GND2  TPPAD1-13  [P1-13]
U500  LT6106  [TSOT-5]
U510  LT6106  [TSOT-5]
U520  2SC1815  [TO-92-R2.5C]
U521  2SJ681  [2-7J2B]
U600  PHT12050WAH  [PHT12050]
U610  PHT12050WAH  [PHT12050]
U620  LTC1983ES6-3  [SOT-23]
U621  LTC1983ES6-5  [SOT-23]
U$17  NC  (no package)
U$19  NC  (no package)
U$27  NC  (no package)
U$28  NC  (no package)
U$30  NC  (no package)
U$31  NC  (no package)

### Nets
5V_PWR_ENADIS: R521.2 ; also sheet 1
5V_SW_OUT: J630.VBUS(VCC) R523.2 U521.P$2(D)
+3V3 [power]: J650_VOUT.P$2 R510.P$1 U510.4(A:+) ; also sheet 1,2
+3V3_BEFORE_SENSE [power]: R510.P$2 R511.1 U510.5(PWR:V+) U610.P$6(V_O)
+5V [power]: C620.2 C623.2 J620.P$1 J640.VBUS(VCC) J650_VOUT.P$1 R500.P$1 R520.2 R601.2 U500.4(A:+) U521.P$3(S) U620.1(VCC) U620.6(/SHDN) U621.1(VCC) U621.6(/SHDN) ; also sheet 1,2
+5V_BEFORE_SENSE [power]: R500.P$2 R501.1 U500.5(PWR:V+) U600.P$6(V_O)
+12V [power]: C600.+ C601.2 C610.+ C611.2 J600_12V.P$1 J600_12V.P$2 J610.TIP U600.P$2(TRACK) U600.P$3(V_I) U610.P$2(TRACK) U610.P$3(V_I) ; also sheet 3
-3V3: -3V.TP C621.1 U620.2(VOUT) ; also sheet 2
-5V: -5V.TP C624.1 J650_VOUT.P$3 U621.2(VOUT) ; also sheet 2
GND [power]: C600.- C601.1 C610.- C611.1 C620.1 C621.2 C623.1 C624.2 GND.TP J600_12V.P$3 J600_12V.P$4 J610.RING J620.P$2 J630.GND J630.GND1(GND) J630.GND2(GND) J640.GND J640.GND1(GND) J640.GND2(GND) J650_VOUT.P$4 LED_5V.P$2(C) LED_5V_SW.P$2(C) R502.1 R512.1 R522.2 R600.1 R610.1 TP_GND2.TP TP_GND.TP U500.2(PWR:V-) U510.2(PWR:V-) U520.1(E) U600.P$1(GND) U610.P$1(GND) U620.5(GND) U621.5(GND) ; supply symbol labelled AGND ; also sheet 1,2,3
N$8: R501.2 U500.3(A:-)
N$9: R511.2 U510.3(A:-)
N$34: J630.D-(DM) U$31.NC
N$59: U600.P$4(INHIBIT) U$17.NC
N$70: LED_5V.P$1(A) R601.1
N$71: R610.2 U610.P$5(ADJUST)
N$72: R520.1 U520.2(C) U521.P$1(G)
N$74: R521.1 R522.1 U520.3(B)
N$75: LED_5V_SW.P$1(A) R523.1
N$76: U610.P$4(INHIBIT) U$19.NC
N$81: C622.2 U620.3(C+)
N$83: C622.1 U620.4(C-)
N$84: R600.2 U600.P$5(ADJUST)
N$88: J630.D+(DP) U$30.NC
N$89: J640.D-(DM) U$28.NC
N$90: J640.D+(DP) U$27.NC
N$91: C625.1 U621.4(C-)
N$108: C625.2 U621.3(C+)
SLOWADC_4: R502.2 U500.1(A:OUT) ; also sheet 1
SLOWADC_5: R512.2 U510.1(A:OUT) ; also sheet 1
Unconnected: J610.RING_SW

### Notes on the sheet
- Current Sense Amp
- Power Connectors (input) | DCDC Modules | DCDC +12V=>+5V
- 本当はR600=280オーム | DCDC +12V=>+3.3V
- パイロットランプ(5V)
- DCDC +5V=>-3V
- Power Connectors (output) | 5V On/Off from Raspberry Pi
- DCDC +5V=>--5V | Vf=1.8V I_F=2mA

## Library data of the parts
1PPS 2.5V -3V -5V AIN0+ AIN0- AIN1+ AIN1- GND GPIO0 GPIO1 P_OUT0 P_OUT1 TP_GND TP_GND2 VR100P2 VR110P2 VR_HV0 VR_HV1 VREF0 VREF1-VREF3 = Aardvark:TP: Test pad
C100-C119 C124-C129 C134-C139 C190-C195 = Aardvark:C2012: SMD Capacitor 2012 (0805)
C197 = Aardvark:C1608: SMC Capacitor 1608 (0603)
C198 C410 C411 C601 C611 C620-C625 = Aardvark:C226-3216: MURATA 22uF 25WV AKIDUKI P-06038 GRM31CB31E226KE15
C600 C610 = rcl:CPOL-US: POLARIZED CAPACITOR, American symbol
IC100 = Aardvark:FT232R: USB-Serial converter http://akizukidenshi.com/download/FT232RL.pdf; MPN: FT232RL; OC_FARNELL: 1146032; OC_NEWARK: 91K9918
IC101 = Aardvark:FT245RL: USB FIFO Controller 4th Generation USB Controller (USB <-> Parallel) - FIFO Copied from http://www.pcserviceselectronics.co.uk/eagle/ftdi.php
J100 J110 J120 J130 = Aardvark:EPL.00.250.NTN: LEMO Connector Elbow receptacle for printed circuit Source: http://intra.lemo.ch/catalog/ROW/UK_English/00and01Coaxial_en.pdf RS: Right angle: http://jp.rs-online.com/web/p/coaxial-plugs-sockets/1248635/ Straight1: http://jp.rs-online.com/web/p/coaxial-plugs-sockets/1243371/ Straight2: http://jp.rs-online.com/web/p/coaxial-plugs-sockets/1248629/; MPN: EPL.00.250.NTN; OC_FARNELL: 3817866; OC_NEWARK: 25R7486; PACKAGE: Through Hole; SUPPLIER: LEMO
J121 J131 J620 = Aardvark:IL-2P-S3EN2: JAE 2pin connector (used by Shimafuji FPGA boards) http://jae-connectors.com/jp/pdf_download_exec.cfm?param=SJ015900.pdf
J180 = Aardvark:TOKUDEN_SP6: Tokuden Spartan-6 FPGA Board
J181 J182 = Aardvark:MINI-USB-RCPT-B-5PS-R/A-SMD(ST-USB-002A): 320010013; MPN: ST-USB-002A
J300 J301 = Aardvark:SHV_PIGTAIL_LAND
J400 = Aardvark:RPI2_GPIO_HOLES: Raspberry Pi 2 GPIO Connector
J410 J411 J_UART = Aardvark:IL-3P-S3EN2: JAE 3pin connector (used by Shimafuji FPGA boards) http://jae-connectors.com/jp/pdf_download_exec.cfm?param=SJ015900.pdf
J600_12V J650_VOUT J_I2C = Aardvark:IL-4P-S3EN2: JAE 4pin connector (used by Shimafuji FPGA boards) http://jae-connectors.com/jp/pdf_download_exec.cfm?param=SJ015900.pdf
J610 = Aardvark:2.1MMJACK: 2.1mm x 5.5mm THM DC jack with internal switch. Digikey part #PJ-102A, 4UCON part #05537 2.1mm x 5.5mm SMT DC jack with internal switch. Digikey part #PJ-002A-SMT, 4UCON part #03267 By microbuilder.eu & adafruit.com
J630 J640 = Aardvark:USB_TYPEA_LUMBERG_2410_01
JP_ADC = Aardvark:PINHD-2X2: PIN HEADER
JP_LCD = Aardvark:LCD16X2
JP_SPI = Aardvark:PINHD-1X5: PIN HEADER
LED_5V LED_5V_SW LED_HV LED_RPI = Aardvark:LED_1608: SMD LED datasheet <http://docs-asia.electrocomponents.com/webdocs/1020/0900766b81020b31.pdf> -------------------------- 色: V 1608 SML-310VTT86 (Vf=2.0V I_F=20mA) RS: 700-7926 <http://jp.rs-online.com/web/p/visible-leds/7007926/> 15円/個 20個単位 -------------------------- 色: 黄色 SML-311WTT86 (Vf=1.8 I_F=2mA) RS: 752-6789 <http://jp.rs-online.com/web/p/visible-leds/7526789/> 11.5円/個 10個単位
R100-R126 R130-R136 R190-R193 R197 R198 R300-R303 R400 R501 R502 R511 R512 R520-R523 R600 R601 R610 R_PZC0 R_PZC1 = Aardvark:R2012: Surface Mount 2012 Type Registor
R500 R510 = Aardvark:R_LVR03: 10mOhm resistor for the current sense amp LT6106. Vishay LVR03R0100FE12 http://docs-asia.electrocomponents.com/webdocs/0d81/0900766b80d81c44.pdf
SJ100 SJ101 SJ110 SJ111 SJ_ADC_MODE = Aardvark:SJ2W: SMD solder JUMPER
U100 U110 U120 U130 = Aardvark:AD9215: 10-bit 65/80/105MSPS 3V A/D Converter Datasheet: http://docs-asia.electrocomponents.com/webdocs/0713/0900766b80713e4c.pdf
U101 U111 U121 U131 = Aardvark:AD8138: Single-ended-to-differential conversion ADC driver http://docs-asia.electrocomponents.com/webdocs/131b/0900766b8131b8af.pdf Power: up to +/-5V
U102 U112 = Aardvark:LM6172: TEXAS INSTRUMENTS Dual High Speed, Low Power, Low Distortion, Voltage Feedback Amplifier LM6172 <http://www.ti.com/lit/ds/symlink/lm6172.pdf>
U191 = Aardvark:GPS_FGPMMOPA6H: GPS FGPMMOPA6H MT3339 TTL -165dBm Integration Of Antenna Module https://www.adafruit.com/datasheets/GlobalTop-FGPMMOPA6H-Datasheet-V0A.pdf
U300 U301 = Aardvark:OPTON_1PA_12
U302 U520 = Aardvark:2SC1815: TOSHIBA Silicon NPN Epitaxial Type (PCT) Transistor Low Frequency Amplifier Complementary pair with 2SA1015 2SC1815 <http://akizukidenshi.com/download/2sc1815-gr.pdf> 50V 150mA 400mW
U303 U521 = Aardvark:2SJ681: 2SJ681 p-ch MOSFET R_DS(ON) = 0.12 @ V_GS=-10V Datasheet <http://toshiba.semicon-storage.com/info/docget.jsp?did=9004&prodName=2SJ681>
U410 = Aardvark:MCP3208: MCP3208 Microchip 2.7V 4-Channel/8-Channel 12-Bit A/D Converters with SPI Serial Interface http://ww1.microchip.com/downloads/en/DeviceDoc/21298e.pdf 12-bit resolution ± 1 LSB max DNL ± 1 LSB max INL (MCP3204/3208-B) ± 2 LSB max INL (MCP3204/3208-C) 4 (MCP3204) or 8 (MCP3208) input channels Analog inputs programmable as single-ended or pseudo-differential pairs On-chip sample and hold SPI serial interface (modes 0,0 and 1,1) Single supply operation: 2.7V - 5.5V 100 ksps max. sampling rate at VDD = 5V 50 ksps max. sampling rate at VDD = 2.7V Low power CMOS technology: - 500 nA typical standby current, 2 μA max. - 400 μA max. active current at 5V Industrial temp range: -40°C to +85°C Available in PDIP, SOIC and TSSOP packages
U411 = Aardvark:MCP1525: Voltage reference 2.5V http://ww1.microchip.com/downloads/en/DeviceDoc/21653C.pdf
U412 U413 = Aardvark:LM60: Temperature sensor 6.25 mV/degC +100degC = 1049mV +25degC = 580mV 0degC = 424mV -25degC = 268mV http://akizukidenshi.com/download/LM60.pdf
U500 U510 = Aardvark:LT6106: Current sense amplifier (Vout=Vsense*(Rout/Rin)) Datasheet <http://cds.linear.com/docs/jp/datasheet/j6106f.pdf>
U600 U610 = Aardvark:PHT12050WAH: DCDC Module 12V input, 1.2-5V output http://docs-asia.electrocomponents.com/webdocs/0c98/0900766b80c98bf9.pdf
U620 = Aardvark:LTC1983ES6-3: DCDC 3.3-5V input, -3V output http://cds.linear.com/docs/en/datasheet/1983fa.pdf
U621 = Aardvark:LTC1983ES6-5: LTC1983ES6-5 DCDC 5V => -5V DatDatasheet <http://docs-asia.electrocomponents.com/webdocs/10ed/0900766b810ed9b0.pdf> RS: 761-9276 <http://jp.rs-online.com/web/p/charge-pumps/7619276/>
U$1-U$3 U$8-U$21 U$23-U$44 = Aardvark:NC
VR100 VR110 VR300 VR301 VR_CONT = Aardvark:DIP-TRIMMER-10K-10%-1/2W(3P-9.7X5.0X9.80MM): T93YA502KT20 Datasheet <http://docs-asia.electrocomponents.com/webdocs/0ed9/0900766b80ed9ad6.pdf> RS Website 788-5079 <http://jp.rs-online.com/web/p/trimmer-resistors/7885079/>; MPN: T93YA103KT20

## Net classes
1 power: width 0.254 mm, clearance 0.178 mm